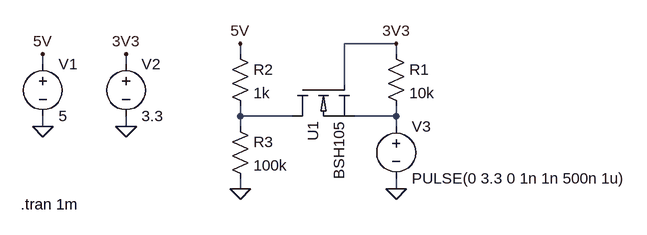
[diagram p0: schematic Level Shifter.asc]
Level Shifter.asc, the LTspice schematic file:
Version 4
SHEET 1 904 680
WIRE 512 96 432 96
WIRE 272 112 272 96
WIRE 512 112 512 96
WIRE -32 128 -32 112
WIRE 96 128 96 112
WIRE 432 160 432 96
WIRE 272 208 272 192
WIRE 352 208 272 208
WIRE 512 208 512 192
WIRE 512 208 448 208
WIRE -32 224 -32 208
WIRE 96 224 96 208
WIRE 272 224 272 208
WIRE 512 224 512 208
WIRE 272 320 272 304
WIRE 512 320 512 304
FLAG 96 224 0
FLAG -32 224 0
FLAG 96 112 3V3
FLAG -32 112 5V
FLAG 272 96 5V
FLAG 512 96 3V3
FLAG 272 320 0
FLAG 512 320 0
SYMBOL voltage -32 112 R0
WINDOW 123 0 0 Left 0
WINDOW 39 0 0 Left 0
SYMATTR InstName V1
SYMATTR Value 5
SYMBOL voltage 96 112 R0
WINDOW 123 0 0 Left 0
WINDOW 39 0 0 Left 0
SYMATTR InstName V2
SYMATTR Value 3.3
SYMBOL res 496 96 R0
SYMATTR InstName R1
SYMATTR Value 10k
SYMBOL res 256 96 R0
SYMATTR InstName R2
SYMATTR Value 1k
SYMBOL AutoGenerated\\BSH105 352 160 M90
SYMATTR InstName U1
SYMBOL voltage 512 208 R0
WINDOW 123 0 0 Left 0
WINDOW 39 0 0 Left 0
SYMATTR InstName V3
SYMATTR Value PULSE(0 3.3 0 1n 1n 500n 1u)
SYMBOL res 256 208 R0
SYMATTR InstName R3
SYMATTR Value 100k
TEXT -66 344 Left 2 !.tran 1m

The netlist it stands for:
* Level Shifter.asc
V1 5V 0 5
V2 3V3 0 3.3
R1 3V3 N002 10k
R2 5V N001 1k
XU1 N001 3V3 N002 BSH105  ; pins D G S
V3 N002 0 PULSE(0 3.3 0 1n 1n 500n 1u)
R3 N001 0 100k
.tran 1m
.lib "BSH105.lib"
.backanno
.end